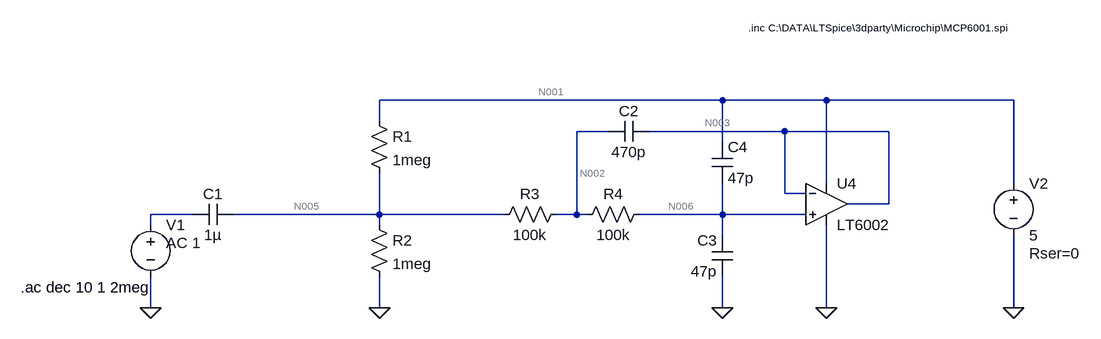
[diagram p0: schematic active filter.asc]
active filter.asc, the LTspice schematic file:
Version 4
SHEET 1 996 680
WIRE 432 32 -96 32
WIRE 592 32 432 32
WIRE 880 32 592 32
WIRE -96 64 -96 32
WIRE 256 80 208 80
WIRE 528 80 320 80
WIRE 688 80 528 80
WIRE 432 96 432 32
WIRE 592 160 592 32
WIRE 880 160 880 32
WIRE 528 176 528 80
WIRE 560 176 528 176
WIRE 688 192 688 80
WIRE 688 192 624 192
WIRE -384 208 -448 208
WIRE -96 208 -96 144
WIRE -96 208 -320 208
WIRE 96 208 -96 208
WIRE 208 208 208 80
WIRE 208 208 176 208
WIRE 224 208 208 208
WIRE 432 208 432 160
WIRE 432 208 304 208
WIRE 560 208 432 208
WIRE -448 224 -448 208
WIRE -96 224 -96 208
WIRE 432 240 432 208
WIRE -448 352 -448 304
WIRE -96 352 -96 304
WIRE 432 352 432 304
WIRE 592 352 592 224
WIRE 880 352 880 240
FLAG 432 352 0
FLAG -448 352 0
FLAG 880 352 0
FLAG 592 352 0
FLAG -96 352 0
SYMBOL cap -320 192 R90
WINDOW 0 0 32 VBottom 2
WINDOW 3 32 32 VTop 2
SYMATTR InstName C1
SYMATTR Value 1µ
SYMBOL cap 256 96 R270
WINDOW 0 32 32 VTop 2
WINDOW 3 0 32 VBottom 2
SYMATTR InstName C2
SYMATTR Value 470p
SYMBOL cap 448 304 R180
WINDOW 0 24 56 Left 2
WINDOW 3 24 8 Left 2
SYMATTR InstName C3
SYMATTR Value 47p
SYMBOL res -112 48 R0
SYMATTR InstName R1
SYMATTR Value 1meg
SYMBOL res -112 208 R0
SYMATTR InstName R2
SYMATTR Value 1meg
SYMBOL res 192 192 R90
WINDOW 0 0 56 VBottom 2
WINDOW 3 32 56 VTop 2
SYMATTR InstName R3
SYMATTR Value 100k
SYMBOL voltage -448 208 R0
WINDOW 123 24 44 Left 2
WINDOW 39 0 0 Left 2
SYMATTR Value2 AC 1
SYMATTR InstName V1
SYMATTR Value ""
SYMBOL voltage 880 144 R0
WINDOW 123 0 0 Left 2
WINDOW 39 24 124 Left 2
SYMATTR SpiceLine Rser=0
SYMATTR InstName V2
SYMATTR Value 5
SYMBOL res 320 192 R90
WINDOW 0 0 56 VBottom 2
WINDOW 3 32 56 VTop 2
SYMATTR InstName R4
SYMATTR Value 100k
SYMBOL Opamps\\LT6002 592 192 R0
SYMATTR InstName U4
SYMBOL cap 416 96 R0
SYMATTR InstName C4
SYMATTR Value 47p
TEXT -648 320 Left 2 !.ac dec 10 1 2meg
TEXT 472 -80 Left 1 !.inc C:\\DATA\\LTSpice\\3dparty\\Microchip\\MCP6001.spi

The netlist it stands for:
* active filter.asc
C1 N005 N004 1µ
C2 N002 N003 470p
C3 0 N006 47p
R1 N001 N005 1meg
R2 N005 0 1meg
R3 N002 N005 100k
V1 N004 0 AC 1
V2 N001 0 5 Rser=0
R4 N006 N002 100k
* U4: LT6002 (symbol Opamps\LT6002 not available, pins judged from their places): In+=N006 In-=N003 V+=N001 V-=0 OUT=N003
C4 N001 N006 47p
.ac dec 10 1 2meg
.inc C:\DATA\LTSpice\3dparty\Microchip\MCP6001.spi
.backanno
.end

* Results of the author's LTspice run, read from the files saved beside the schematic
* Operating Point, zero values left out:
*   V(n005) = 2.501 V
*   V(n002) = 2.501 V
*   V(n003) = 2.501 V
*   V(n006) = 2.501 V
*   V(n001) = 5 V
*   I(R4) = 2.109 nA
*   I(R3) = 2.109 nA
*   I(R2) = 2.501 µA
*   I(R1) = 2.499 µA
*   I(V2) = -16.3 µA
*   Ix(u4:1) = -2.109 nA
*   Ix(u4:2) = -2.109 nA
*   Ix(u4:3) = 13.8 µA
*   Ix(u4:4) = -13.8 µA
*   Ix(u4:5) = 2.109 nA